# Altium schematic sheet Main.SchDoc: Gain Switch
size A4; DrawnBy: bgw50; Address1: ECE Department; Address2: University of Canterbury; Address3: Christchurch 8041; Address4: New Zealand; Revision: 1; SheetNumber: 3; SheetTotal: 3
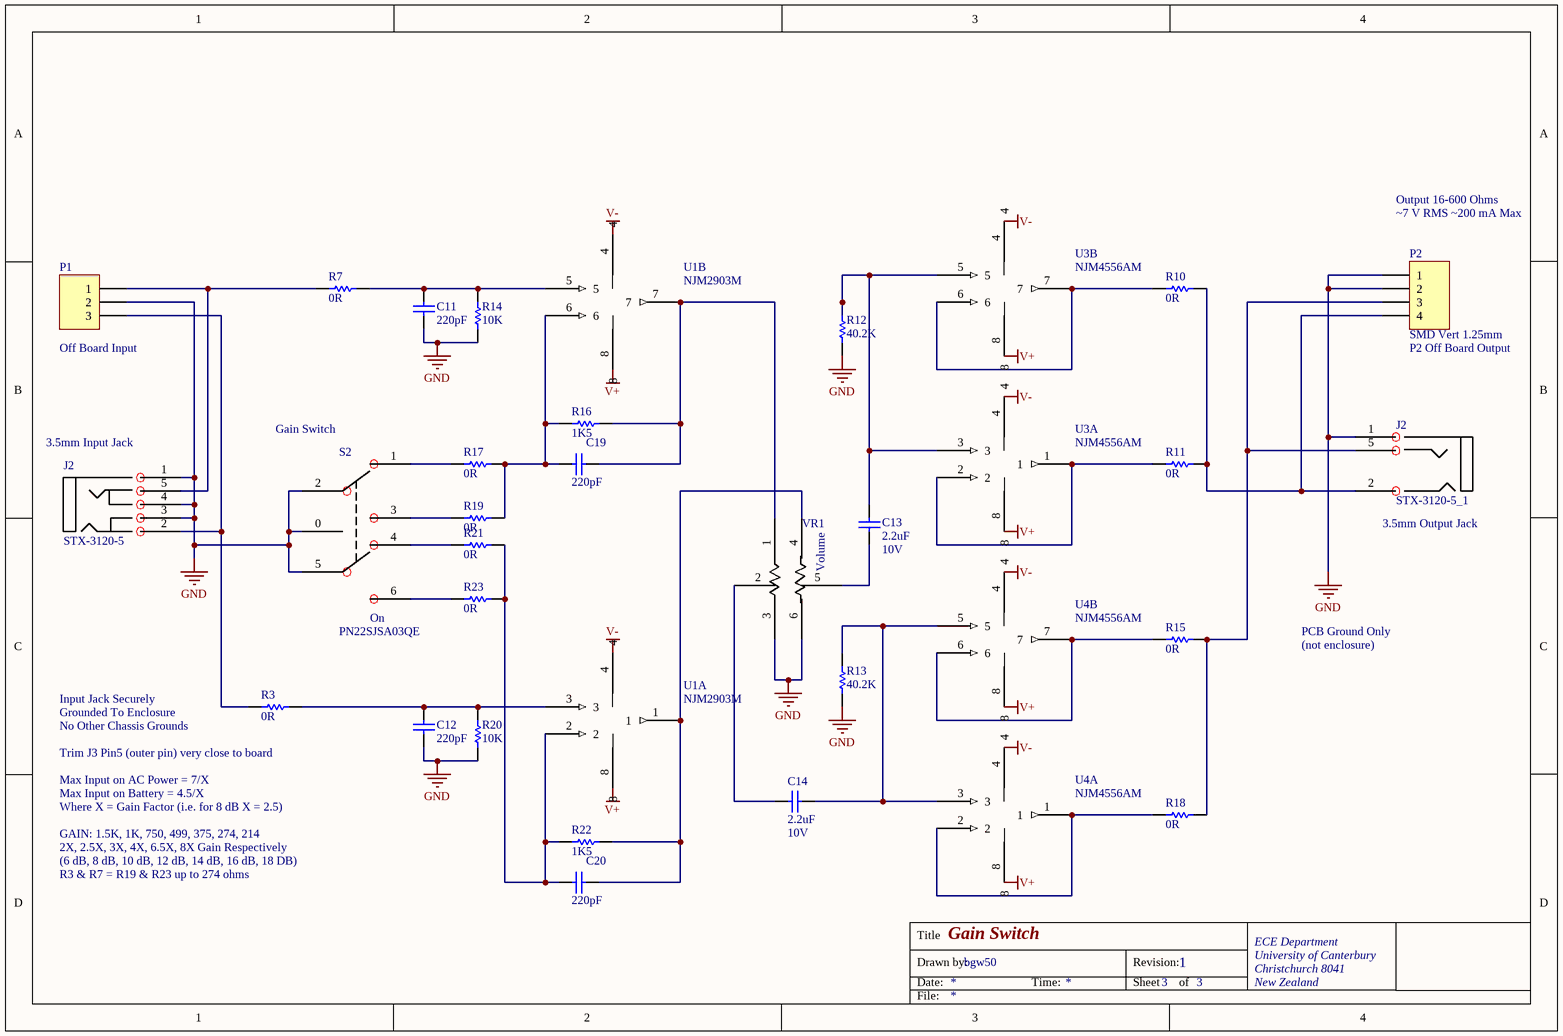
[diagram p0: Main.SchDoc]

## Parts
(Parts that share a designator on the sheet are numbered #1, #2 ... from top to bottom, then left to right.)
C11  220pF  [CAPC1608L]
C12  220pF  [CAPC1608L]
C13  Max Voltage: 10V  [CAPC1608L]  (hidden comment: 2.2uF)
C14  Max Voltage: 10V  [CAPC1608L]  (hidden comment: 2.2uF)
C19  220pF  [CAPC1608L]
C20  220pF  [CAPC1608L]
J2#1  STX-3120-5_1
J2#2  STX-3120-5
P1  SMD Horiz 1.25mm  [SD-53261-0319]  (value not drawn)
P2  SMD Vert 1.25mm  [SD-53398-0419]
R3  0R  [RESC1608L]
R7  0R  [RESC1608L]
R10  0R  [RESC1608L]
R11  0R  [RESC1608L]
R12  40.2K  [RESC1608L]
R13  40.2K  [RESC1608L]
R14  10K  [RESC1608L]
R15  0R  [RESC1608L]
R16  1K5  [RESC1608L]
R17  0R  [RESC1608L]
R18  0R  [RESC1608L]
R19  0R  [RESC1608L]
R20  10K  [RESC1608L]
R21  0R  [RESC1608L]
R22  1K5  [RESC1608L]
R23  0R  [RESC1608L]
S2  PN22SJSA03QE
U1  NJM2903M  [NJM2903M]  (parts A,B of 2)
U3  NJM4556AM  [NJM2903M]  (parts A,B of 2)
U4  NJM4556AM  [NJM2903M]  (parts A,B of 2)
VR1  (no value)

## Nets
GND: C11.1 C12.1 P1.2 P2.1 P2.2 R12.1 R13.1 R14.1 R20.1 VR1.3 VR1.6
NetC11_2: C11.2 R7.2 R14.2 U1.5
NetC12_2: C12.2 R3.2 R20.2 U1.3
NetC13_1: C13.1 VR1.5
NetC13_2: C13.2 R12.2 U3.3 U3.5
NetC14_1: C14.1 VR1.2
NetC14_2: C14.2 R13.2 U4.3 U4.5
NetC19_1: C19.1 R16.1 R17.2 R19.2 U1.6
NetC19_2: C19.2 R16.2 U1.7 VR1.1
NetC20_1: C20.1 R21.2 R22.1 R23.2 U1.2
NetC20_2: C20.2 R22.2 U1.1 VR1.4
NetP1_1: P1.1 R7.1
NetP1_3: P1.3 R3.1
NetP2_3: P2.3 R15.2 R18.2
NetP2_4: P2.4 R10.2 R11.2
NetR10_1: R10.1 U3.6 U3.7
NetR11_1: R11.1 U3.1 U3.2
NetR15_1: R15.1 U4.6 U4.7
NetR18_1: R18.1 U4.1 U4.2

Not connected (* = marked no-connect by the designer): J2#1 1 2 5; J2#2 1 2 3 4 5; R17 1; R19 1; R21 1; R23 1; S2 0 1 2 3 4 5 6; U1 4 8; U3 4 8; U4 4 8

## Notes on the sheet
- Output 16-600 Ohms
- ~7 V RMS ~200 mA Max
- (near P1) Off Board Input
- (near P2) P2 Off Board Output
- (near J2#2) 3.5mm Input Jack
- (near S2) Gain Switch
- (near VR1) Volume
- (near J2#1) 3.5mm Output Jack
- PCB Ground Only
- (not enclosure)
- Input Jack Securely
- Grounded To Enclosure
- No Other Chassis Grounds
- (near R3) Trim J3 Pin5 (outer pin) very close to board
- Max Input on AC Power = 7/X
- Max Input on Battery = 4.5/X
- Where X = Gain Factor (i.e. for 8 dB X = 2.5)
- GAIN: 1.5K, 1K, 750, 499, 375, 274, 214
- 2X, 2.5X, 3X, 4X, 6.5X, 8X Gain Respectively
- (6 dB, 8 dB, 10 dB, 12 dB, 14 dB, 16 dB, 18 DB)
- R3 & R7 = R19 & R23 up to 274 ohms
- Labels drawn without touching a wire or pin: V+, V-
- Title
- Drawn by:
- Date:
- Time:
- Revision:
- Sheet
- of
- File:
- (in symbol PN22SJSA03QE) On

## Library data of the parts
C11 C12 C19 C20 = CC_220pF_0603: CAP CER 220pF NPO/COG +-5% 50V 0603; PackageReference: 0603; Code_IPC: 1608 [0603]; Verify: *; Supplier: ECE Dept; Storage Location: PCB Assembly WS; Value: 220pF
C13 C14 = CC_2.2uF_0603: CAP CER 2.2uF X5R +-20% 10V 0603; PackageReference: 0603; Code_IPC: 1608 [0603]; Verify: *; Supplier: ECE Dept; Storage Location: PCB Assembly WS; Value: 2.2uF
P1 = JB_53261-03: Header_Horiz_3Pos_1.25mm_125V@1A_SMT; Manufacturer: Molex; Manufacturer Part Number: 53261-0390; Number of Positions: 3; Pitch: 0.049" (1.25mm); Contact Type: Blade Pin; Mounting Type: Surface Mount, Right Angle; Supplier 1: Farnell; Supplier Part Number 1: 1125359; Supplier 2: Digi-Key; Supplier Part Number 2: WM1754CT-ND; Supplier: ECE Dept; Storage Location: PCB Assembly WS; Value: SMD Horiz 1.25mm
P2 = JB_53398-04: Header_Vert_4Pos_1.25mm_125V@1A_SMT; Manufacturer: MOLEX; Manufacturer Part Number: 53398-0471; Contact Termination: Surface Mount Vertical; Current Rating: 1; Lead Spacing: 1.25; Series: PicoBlade; Supplier 1: Farnell; Supplier Part Number 1: 1125367; Supplier: ECE Dept; Storage Location: PCB Assembly WS; Value: SMD Vert 1.25mm
R3 R7 R10 R11 R15 R17-R19 R21 R23 = RS_0R0: RES 0.0 OHM 1/10W 5% 0603 SMD; Storage Location: PCB Assembly WS; Supplier: ECE Dept; Value: 0R
R12 R13 = RS_39K: RES 39K OHM 1/10W 5% 0603 SMD; Storage Location: PCB Assembly WS; Supplier: ECE Dept; Value: 40.2K
R14 R20 = RS_10K: RES 10.0K OHM 1/10W 5% 0603 SMD; Storage Location: PCB Assembly WS; Supplier: ECE Dept; Value: 10K
R16 R22 = RS_1K5: RES 1.5K OHM 1/10W 5% 0603 SMD; Storage Location: PCB Assembly WS; Supplier: ECE Dept; Value: 1K5
U1 U3 U4 = NJM2903D
VR1 = RK09